# EAGLE design flipdotctl (EAGLE 6.4)

## Sheet 1 of 6
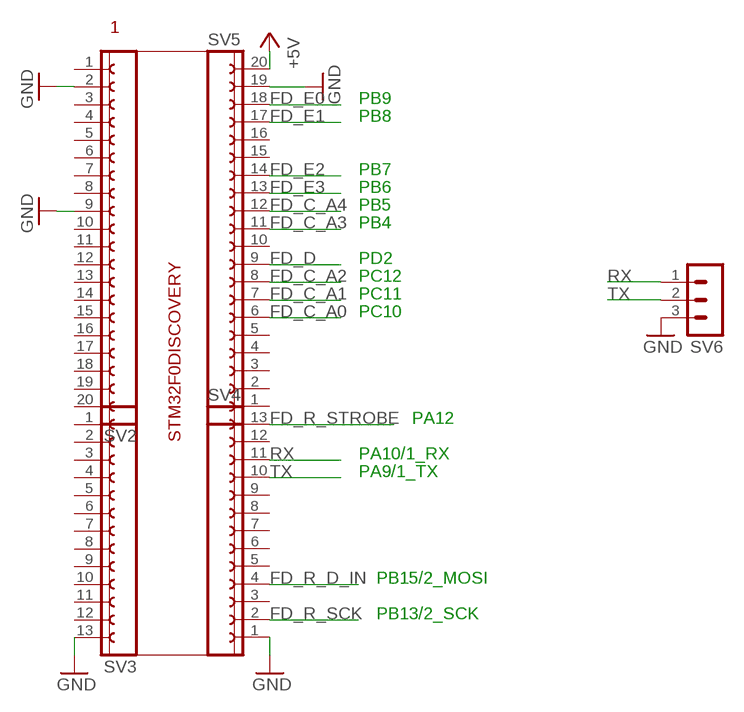
[diagram p0: schematic, sheet 1]

### Parts
SV2  FE20-1  [FE20]
SV3  FE13-1  [FE13]
SV4  FE13-1  [FE13]
SV5  FE20-1  [FE20]
SV6  MA03-1  [MA03-1]

### Nets
+5V: SV5.20 ; also sheet 2,3,4,5,6
FD_C_A0: SV5.6 ; also sheet 3
FD_C_A1: SV5.7 ; also sheet 3
FD_C_A2: SV5.8 ; also sheet 3
FD_C_A3: SV5.11 ; also sheet 3
FD_C_A4: SV5.12 ; also sheet 3
FD_D: SV5.9 ; also sheet 3
FD_E0: SV5.18 ; also sheet 3
FD_E1: SV5.17 ; also sheet 3
FD_E2: SV5.14 ; also sheet 3
FD_E3: SV5.13 ; also sheet 3
FD_R_D_IN: SV4.4 ; also sheet 4
FD_R_SCK: SV4.2 ; also sheet 4,5
FD_R_STROBE: SV4.13 ; also sheet 4,5
GND: SV2.2 SV2.9 SV3.13 SV4.1 SV5.19 SV6.3 ; also sheet 2,3,4,5,6
RX: SV4.11 SV6.1
TX: SV4.10 SV6.2
Unconnected: SV2.1 SV2.3 SV2.4 SV2.5 SV2.6 SV2.7 SV2.8 SV2.10 SV2.11 SV2.12 SV2.13 SV2.14 SV2.15 SV2.16 SV2.17 SV2.18 SV2.19 SV2.20 SV3.1 SV3.2 SV3.3 SV3.4 SV3.5 SV3.6 SV3.7 SV3.8 SV3.9 SV3.10 SV3.11 SV3.12 SV4.3 SV4.5 SV4.6 SV4.7 SV4.8 SV4.9 SV4.12 SV5.1 SV5.2 SV5.3 SV5.4 SV5.5 SV5.10 SV5.15 SV5.16

### Notes on the sheet
- 1
- PB9
- PB8
- PB7
- PB6
- PB5
- PB4
- PD2
- PC12
- PC11
- PC10
- PA12
- STM32F0DISCOVERY
- PA10/1_RX
- PA9/1_TX
- PB15/2_MOSI
- PB13/2_SCK

## Sheet 2 of 6
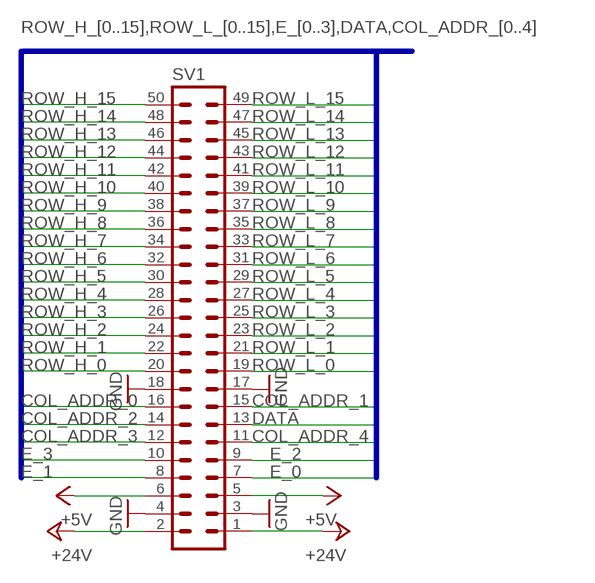
[diagram p1: schematic, sheet 2]

### Parts
SV1  ML50  [ML50]

### Nets
+5V: SV1.5 SV1.6 ; also sheet 1,3,4,5,6
+24V: SV1.1 SV1.2 ; also sheet 5,6
COL_ADDR_0: SV1.16 ; also sheet 3
COL_ADDR_1: SV1.15 ; also sheet 3
COL_ADDR_2: SV1.14 ; also sheet 3
COL_ADDR_3: SV1.12 ; also sheet 3
COL_ADDR_4: SV1.11 ; also sheet 3
DATA: SV1.13 ; also sheet 3
E_0: SV1.7 ; also sheet 3
E_1: SV1.8 ; also sheet 3
E_2: SV1.9 ; also sheet 3
E_3: SV1.10 ; also sheet 3
GND: SV1.3 SV1.4 SV1.17 SV1.18 ; also sheet 1,3,4,5,6
ROW_H_0: SV1.20 ; also sheet 5
ROW_H_1: SV1.22 ; also sheet 5
ROW_H_2: SV1.24 ; also sheet 5
ROW_H_3: SV1.26 ; also sheet 5
ROW_H_4: SV1.28 ; also sheet 5
ROW_H_5: SV1.30 ; also sheet 5
ROW_H_6: SV1.32 ; also sheet 5
ROW_H_7: SV1.34 ; also sheet 5
ROW_H_8: SV1.36 ; also sheet 5
ROW_H_9: SV1.38 ; also sheet 5
ROW_H_10: SV1.40 ; also sheet 5
ROW_H_11: SV1.42 ; also sheet 5
ROW_H_12: SV1.44 ; also sheet 5
ROW_H_13: SV1.46 ; also sheet 5
ROW_H_14: SV1.48 ; also sheet 5
ROW_H_15: SV1.50 ; also sheet 5
ROW_L_0: SV1.19 ; also sheet 4
ROW_L_1: SV1.21 ; also sheet 4
ROW_L_2: SV1.23 ; also sheet 4
ROW_L_3: SV1.25 ; also sheet 4
ROW_L_4: SV1.27 ; also sheet 4
ROW_L_5: SV1.29 ; also sheet 4
ROW_L_6: SV1.31 ; also sheet 4
ROW_L_7: SV1.33 ; also sheet 4
ROW_L_8: SV1.35 ; also sheet 4
ROW_L_9: SV1.37 ; also sheet 4
ROW_L_10: SV1.39 ; also sheet 4
ROW_L_11: SV1.41 ; also sheet 4
ROW_L_12: SV1.43 ; also sheet 4
ROW_L_13: SV1.45 ; also sheet 4
ROW_L_14: SV1.47 ; also sheet 4
ROW_L_15: SV1.49 ; also sheet 4

### Buses
ROW_H_[0..15],ROW_L_[0..15],E_[0..3],DATA,COL_ADDR_[0..4]

## Sheet 3 of 6
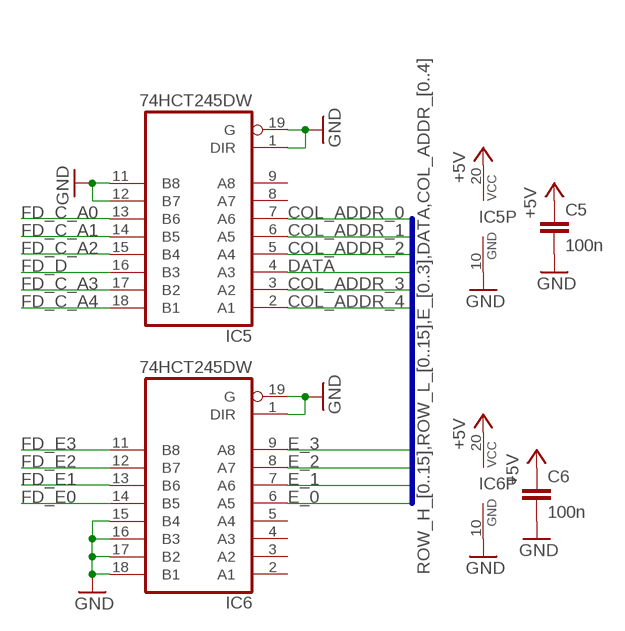
[diagram p2: schematic, sheet 3]

### Parts
C5  100n  C-EUC0603  [C0603]
C6  100n  C-EUC0603  [C0603]
IC5  74HCT245DW  [SO20W]
IC6  74HCT245DW  [SO20W]

### Nets
+5V: C5.1 C6.1 IC5.20(VCC) IC6.20(VCC) ; also sheet 1,2,4,5,6
COL_ADDR_0: IC5.7(A6) ; also sheet 2
COL_ADDR_1: IC5.6(A5) ; also sheet 2
COL_ADDR_2: IC5.5(A4) ; also sheet 2
COL_ADDR_3: IC5.3(A2) ; also sheet 2
COL_ADDR_4: IC5.2(A1) ; also sheet 2
DATA: IC5.4(A3) ; also sheet 2
E_0: IC6.6(A5) ; also sheet 2
E_1: IC6.7(A6) ; also sheet 2
E_2: IC6.8(A7) ; also sheet 2
E_3: IC6.9(A8) ; also sheet 2
FD_C_A0: IC5.13(B6) ; also sheet 1
FD_C_A1: IC5.14(B5) ; also sheet 1
FD_C_A2: IC5.15(B4) ; also sheet 1
FD_C_A3: IC5.17(B2) ; also sheet 1
FD_C_A4: IC5.18(B1) ; also sheet 1
FD_D: IC5.16(B3) ; also sheet 1
FD_E0: IC6.14(B5) ; also sheet 1
FD_E1: IC6.13(B6) ; also sheet 1
FD_E2: IC6.12(B7) ; also sheet 1
FD_E3: IC6.11(B8) ; also sheet 1
GND: C5.2 C6.2 IC5.1(DIR) IC5.10(GND) IC5.11(B8) IC5.12(B7) IC5.19(G) IC6.1(DIR) IC6.10(GND) IC6.15(B4) IC6.16(B3) IC6.17(B2) IC6.18(B1) IC6.19(G) ; also sheet 1,2,4,5,6
Unconnected: IC5.8(A7) IC5.9(A8) IC6.2(A1) IC6.3(A2) IC6.4(A3) IC6.5(A4)

### Buses
ROW_H_[0..15],ROW_L_[0..15],E_[0..3],DATA,COL_ADDR_[0..4]

## Sheet 4 of 6
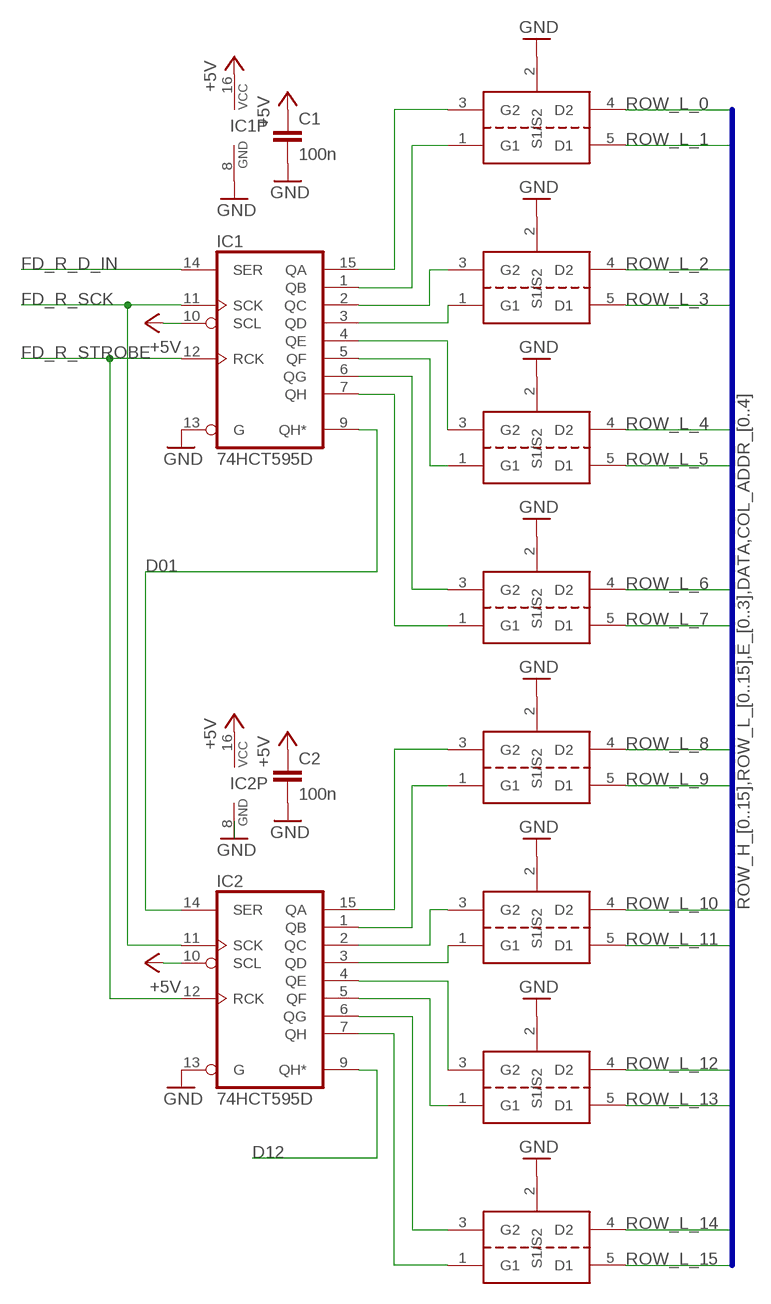
[diagram p3: schematic, sheet 4]

### Parts
C1  100n  C-EUC0603  [C0603]
C2  100n  C-EUC0603  [C0603]
IC1  74HCT595D  [SO16]
IC2  74HCT595D  [SO16]
U$1  QS5K2  [SOT23-5L]
U$2  QS5K2  [SOT23-5L]
U$3  QS5K2  [SOT23-5L]
U$4  QS5K2  [SOT23-5L]
U$5  QS5K2  [SOT23-5L]
U$6  QS5K2  [SOT23-5L]
U$7  QS5K2  [SOT23-5L]
U$8  QS5K2  [SOT23-5L]

### Nets
+5V: C1.1 C2.1 IC1.10(SCL) IC1.16(VCC) IC2.10(SCL) IC2.16(VCC) ; also sheet 1,2,3,5,6
D01: IC1.9(QH*) IC2.14(SER)
D12: IC2.9(QH*) ; also sheet 5
FD_R_D_IN: IC1.14(SER) ; also sheet 1
FD_R_SCK: IC1.11(SCK) IC2.11(SCK) ; also sheet 1,5
FD_R_STROBE: IC1.12(RCK) IC2.12(RCK) ; also sheet 1,5
GND: C1.2 C2.2 IC1.8(GND) IC1.13(G) IC2.8(GND) IC2.13(G) U$1.2(S1/S2) U$2.2(S1/S2) U$3.2(S1/S2) U$4.2(S1/S2) U$5.2(S1/S2) U$6.2(S1/S2) U$7.2(S1/S2) U$8.2(S1/S2) ; also sheet 1,2,3,5,6
L_0: IC1.15(QA) U$1.3(G2)
L_1: IC1.1(QB) U$1.1(G1)
L_2: IC1.2(QC) U$2.3(G2)
L_3: IC1.3(QD) U$2.1(G1)
L_4: IC1.4(QE) U$3.3(G2)
L_5: IC1.5(QF) U$3.1(G1)
L_6: IC1.6(QG) U$4.3(G2)
L_7: IC1.7(QH) U$4.1(G1)
L_8: IC2.15(QA) U$5.3(G2)
L_9: IC2.1(QB) U$5.1(G1)
L_10: IC2.2(QC) U$6.3(G2)
L_11: IC2.3(QD) U$6.1(G1)
L_12: IC2.4(QE) U$7.3(G2)
L_13: IC2.5(QF) U$7.1(G1)
L_14: IC2.6(QG) U$8.3(G2)
L_15: IC2.7(QH) U$8.1(G1)
ROW_L_0: U$1.4(D2) ; also sheet 2
ROW_L_1: U$1.5(D1) ; also sheet 2
ROW_L_2: U$2.4(D2) ; also sheet 2
ROW_L_3: U$2.5(D1) ; also sheet 2
ROW_L_4: U$3.4(D2) ; also sheet 2
ROW_L_5: U$3.5(D1) ; also sheet 2
ROW_L_6: U$4.4(D2) ; also sheet 2
ROW_L_7: U$4.5(D1) ; also sheet 2
ROW_L_8: U$5.4(D2) ; also sheet 2
ROW_L_9: U$5.5(D1) ; also sheet 2
ROW_L_10: U$6.4(D2) ; also sheet 2
ROW_L_11: U$6.5(D1) ; also sheet 2
ROW_L_12: U$7.4(D2) ; also sheet 2
ROW_L_13: U$7.5(D1) ; also sheet 2
ROW_L_14: U$8.4(D2) ; also sheet 2
ROW_L_15: U$8.5(D1) ; also sheet 2

### Buses
ROW_H_[0..15],ROW_L_[0..15],E_[0..3],DATA,COL_ADDR_[0..4]

## Sheet 5 of 6
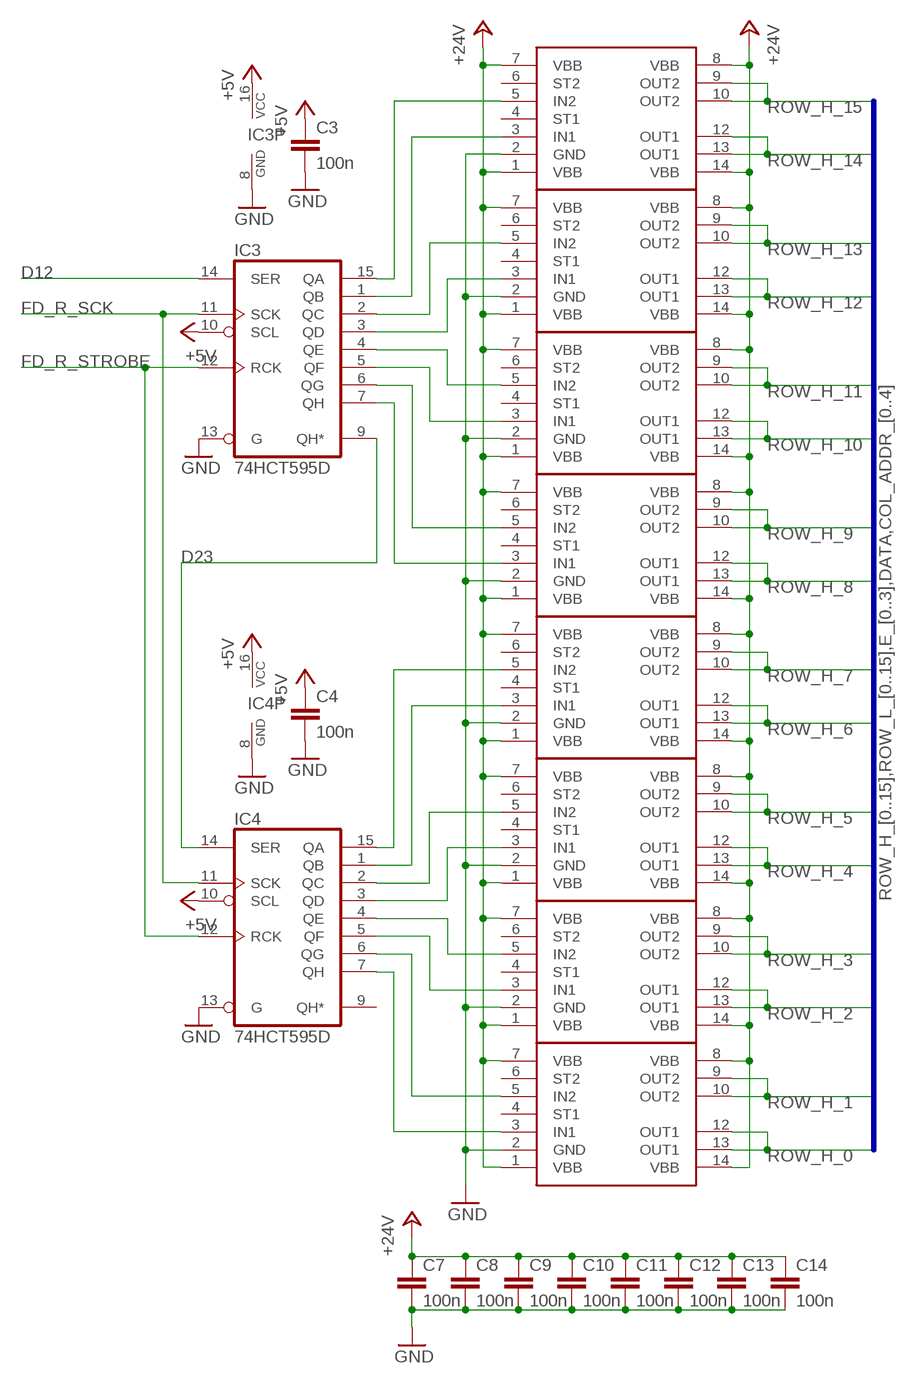
[diagram p4: schematic, sheet 5]

### Parts
C3  100n  C-EUC0603  [C0603]
C4  100n  C-EUC0603  [C0603]
C7  100n  C-EUC0603  [C0603]
C8  100n  C-EUC0603  [C0603]
C9  100n  C-EUC0603  [C0603]
C10  100n  C-EUC0603  [C0603]
C11  100n  C-EUC0603  [C0603]
C12  100n  C-EUC0603  [C0603]
C13  100n  C-EUC0603  [C0603]
C14  100n  C-EUC0603  [C0603]
IC3  74HCT595D  [SO16]
IC4  74HCT595D  [SO16]
U$9  BTS5210G  [SO-14]
U$10  BTS5210G  [SO-14]
U$11  BTS5210G  [SO-14]
U$12  BTS5210G  [SO-14]
U$13  BTS5210G  [SO-14]
U$14  BTS5210G  [SO-14]
U$15  BTS5210G  [SO-14]
U$16  BTS5210G  [SO-14]

### Nets
+5V: C3.1 C4.1 IC3.10(SCL) IC3.16(VCC) IC4.10(SCL) IC4.16(VCC) ; also sheet 1,2,3,4,6
+24V: C7.1 C8.1 C9.1 C10.1 C11.1 C12.1 C13.1 C14.1 U$9.1(VBB) U$9.7(VBB) U$9.8(VBB) U$9.14(VBB) U$10.1(VBB) U$10.7(VBB) U$10.8(VBB) U$10.14(VBB) U$11.1(VBB) U$11.7(VBB) U$11.8(VBB) U$11.14(VBB) U$12.1(VBB) U$12.7(VBB) U$12.8(VBB) U$12.14(VBB) U$13.1(VBB) U$13.7(VBB) U$13.8(VBB) U$13.14(VBB) U$14.1(VBB) U$14.7(VBB) U$14.8(VBB) U$14.14(VBB) U$15.1(VBB) U$15.7(VBB) U$15.8(VBB) U$15.14(VBB) U$16.1(VBB) U$16.7(VBB) U$16.8(VBB) U$16.14(VBB) ; also sheet 2,6
D12: IC3.14(SER) ; also sheet 4
D23: IC3.9(QH*) IC4.14(SER)
FD_R_SCK: IC3.11(SCK) IC4.11(SCK) ; also sheet 1,4
FD_R_STROBE: IC3.12(RCK) IC4.12(RCK) ; also sheet 1,4
GND: C3.2 C4.2 C7.2 C8.2 C9.2 C10.2 C11.2 C12.2 C13.2 C14.2 IC3.8(GND) IC3.13(G) IC4.8(GND) IC4.13(G) U$9.2(GND) U$10.2(GND) U$11.2(GND) U$12.2(GND) U$13.2(GND) U$14.2(GND) U$15.2(GND) U$16.2(GND) ; also sheet 1,2,3,4,6
H_0: IC4.7(QH) U$9.3(IN1)
H_1: IC4.6(QG) U$9.5(IN2)
H_2: IC4.5(QF) U$10.3(IN1)
H_3: IC4.4(QE) U$10.5(IN2)
H_4: IC4.3(QD) U$11.3(IN1)
H_5: IC4.2(QC) U$11.5(IN2)
H_6: IC4.1(QB) U$12.3(IN1)
H_7: IC4.15(QA) U$12.5(IN2)
H_8: IC3.7(QH) U$13.3(IN1)
H_9: IC3.6(QG) U$13.5(IN2)
H_10: IC3.5(QF) U$14.3(IN1)
H_11: IC3.4(QE) U$14.5(IN2)
H_12: IC3.3(QD) U$15.3(IN1)
H_13: IC3.2(QC) U$15.5(IN2)
H_14: IC3.1(QB) U$16.3(IN1)
H_15: IC3.15(QA) U$16.5(IN2)
ROW_H_0: U$9.12(OUT1) U$9.13(OUT1) ; also sheet 2
ROW_H_1: U$9.9(OUT2) U$9.10(OUT2) ; also sheet 2
ROW_H_2: U$10.12(OUT1) U$10.13(OUT1) ; also sheet 2
ROW_H_3: U$10.9(OUT2) U$10.10(OUT2) ; also sheet 2
ROW_H_4: U$11.12(OUT1) U$11.13(OUT1) ; also sheet 2
ROW_H_5: U$11.9(OUT2) U$11.10(OUT2) ; also sheet 2
ROW_H_6: U$12.12(OUT1) U$12.13(OUT1) ; also sheet 2
ROW_H_7: U$12.9(OUT2) U$12.10(OUT2) ; also sheet 2
ROW_H_8: U$13.12(OUT1) U$13.13(OUT1) ; also sheet 2
ROW_H_9: U$13.9(OUT2) U$13.10(OUT2) ; also sheet 2
ROW_H_10: U$14.12(OUT1) U$14.13(OUT1) ; also sheet 2
ROW_H_11: U$14.9(OUT2) U$14.10(OUT2) ; also sheet 2
ROW_H_12: U$15.12(OUT1) U$15.13(OUT1) ; also sheet 2
ROW_H_13: U$15.9(OUT2) U$15.10(OUT2) ; also sheet 2
ROW_H_14: U$16.12(OUT1) U$16.13(OUT1) ; also sheet 2
ROW_H_15: U$16.9(OUT2) U$16.10(OUT2) ; also sheet 2
Unconnected: IC4.9(QH*) U$9.4(ST1) U$9.6(ST2) U$10.4(ST1) U$10.6(ST2) U$11.4(ST1) U$11.6(ST2) U$12.4(ST1) U$12.6(ST2) U$13.4(ST1) U$13.6(ST2) U$14.4(ST1) U$14.6(ST2) U$15.4(ST1) U$15.6(ST2) U$16.4(ST1) U$16.6(ST2)

### Buses
ROW_H_[0..15],ROW_L_[0..15],E_[0..3],DATA,COL_ADDR_[0..4]

## Sheet 6 of 6
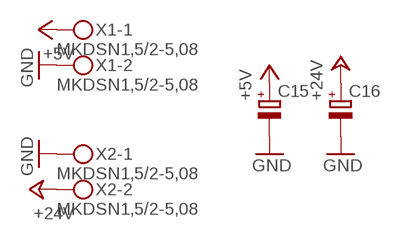
[diagram p5: schematic, sheet 6]

### Parts
C15  CPOL-EUE2.5-6  [E2,5-6]
C16  CPOL-EUE2.5-6  [E2,5-6]
X1  MKDSN1,5/2-5,08  [MKDSN1,5/2-5,08]
X2  MKDSN1,5/2-5,08  [MKDSN1,5/2-5,08]

### Nets
+5V: C15.+ X1.1 ; also sheet 1,2,3,4,5
+24V: C16.+ X2.2 ; also sheet 2,5
GND: C15.- C16.- X1.2 X2.1 ; also sheet 1,2,3,4,5

## Library data of the parts
C1-C14 = rcl:C-EU: CAPACITOR, European symbol
C15 C16 = rcl:CPOL-EU: POLARIZED CAPACITOR, European symbol
IC1-IC4 = 74xx-eu:74*595: 8-bit SHIFT REGISTER, output latch
IC5 IC6 = 74xx-eu:74*245: Octal BUS TRANSCEIVER, 3-state
SV1 = con-ml:ML50: HARTING; OC_FARNELL: unknown; OC_NEWARK: unknown
SV2 SV5 = con-lsta:FE20-1: FEMALE HEADER; OC_FARNELL: unknown; OC_NEWARK: unknown
SV3 SV4 = con-lsta:FE13-1: FEMALE HEADER; OC_FARNELL: unknown; OC_NEWARK: unknown
SV6 = con-lstb:MA03-1: PIN HEADER; OC_FARNELL: unknown; OC_NEWARK: unknown
U$1-U$8 = qs5k2:QS5K2
U$9-U$16 = BTS5210G:BTS5210G
X1 X2 = con-phoenix-508:MKDSN1,5/2-5,08: MKDSN 1,5/ 2-5,08 Printklemme Nennstrom: 13,5 A Nennspannung: 250 V Rastermaß: 5,08 mm Polzahl: 2 Anschlussart: Schraubanschluss Montage: Löten Anschlussrichtung Leiter/Platine: 0 ° Artikelnummer: 1729128 Source: http://eshop.phoenixcontact.com .. 1729128.pdf; MPN: MKDSN 1,5/2-5.08; OC_FARNELL: 1792903; OC_NEWARK: 30M2397

## Board
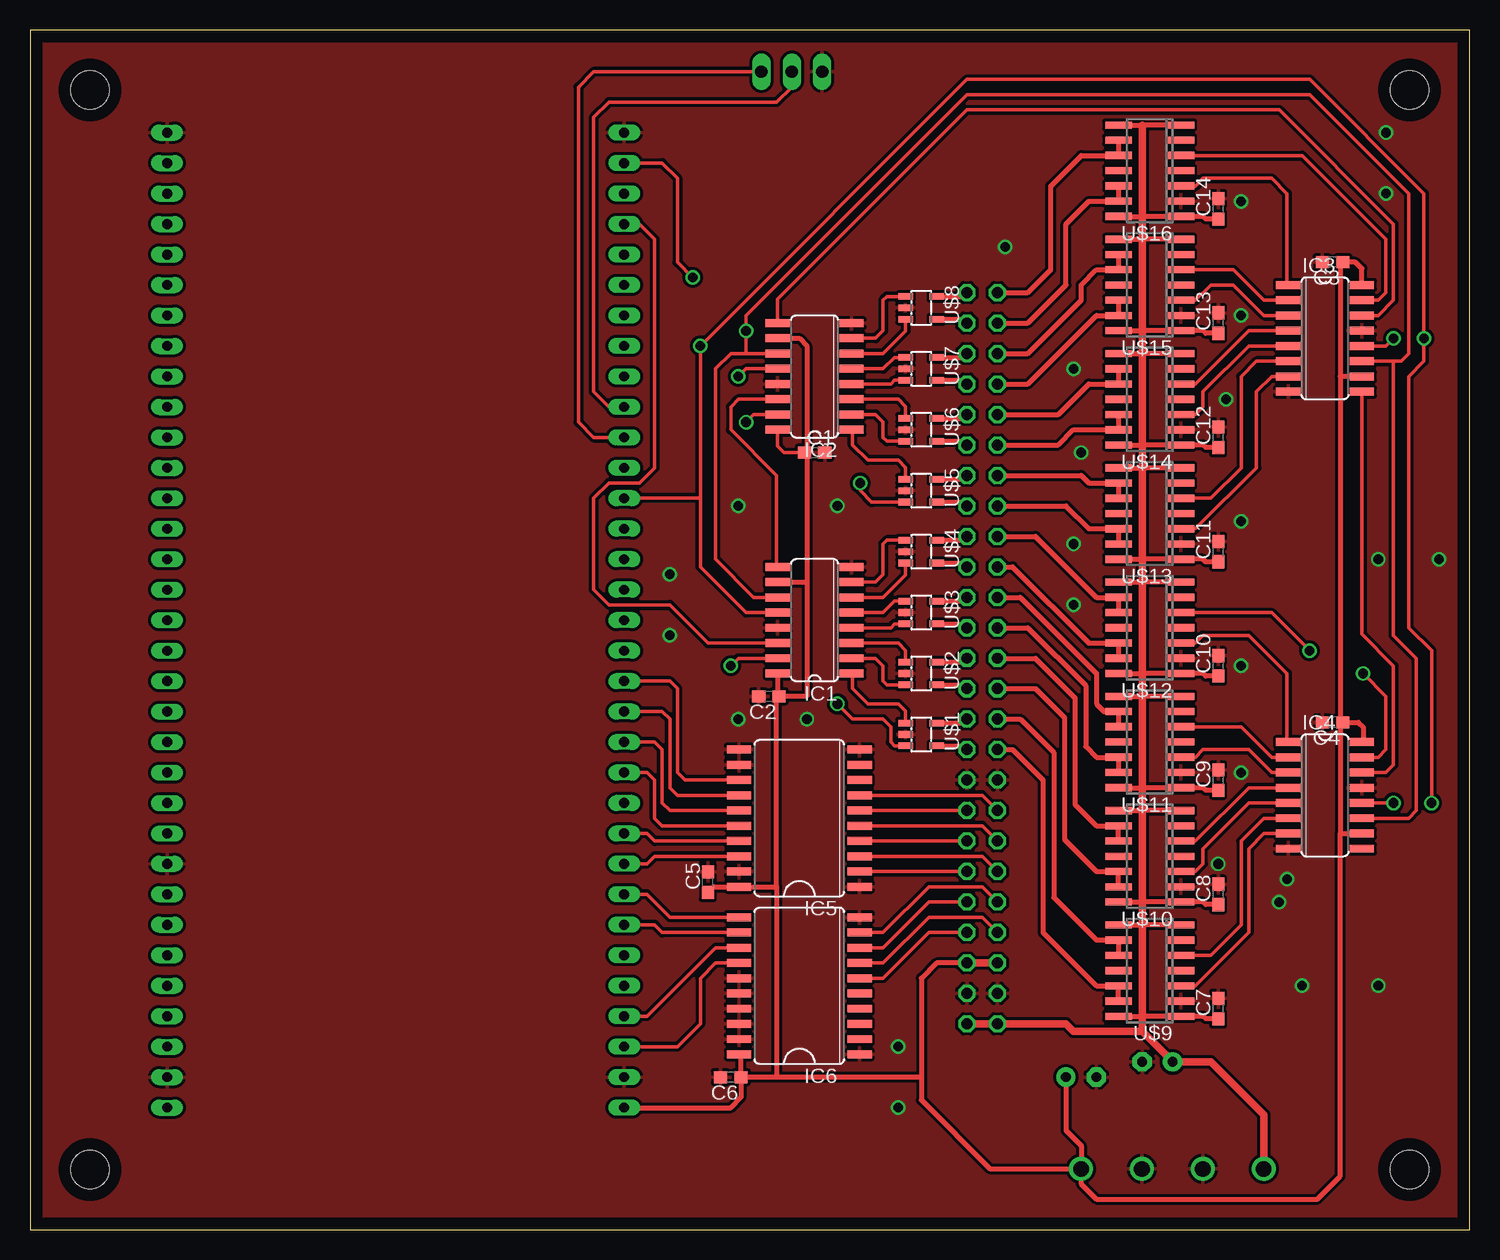
[diagram p6: board, top side]
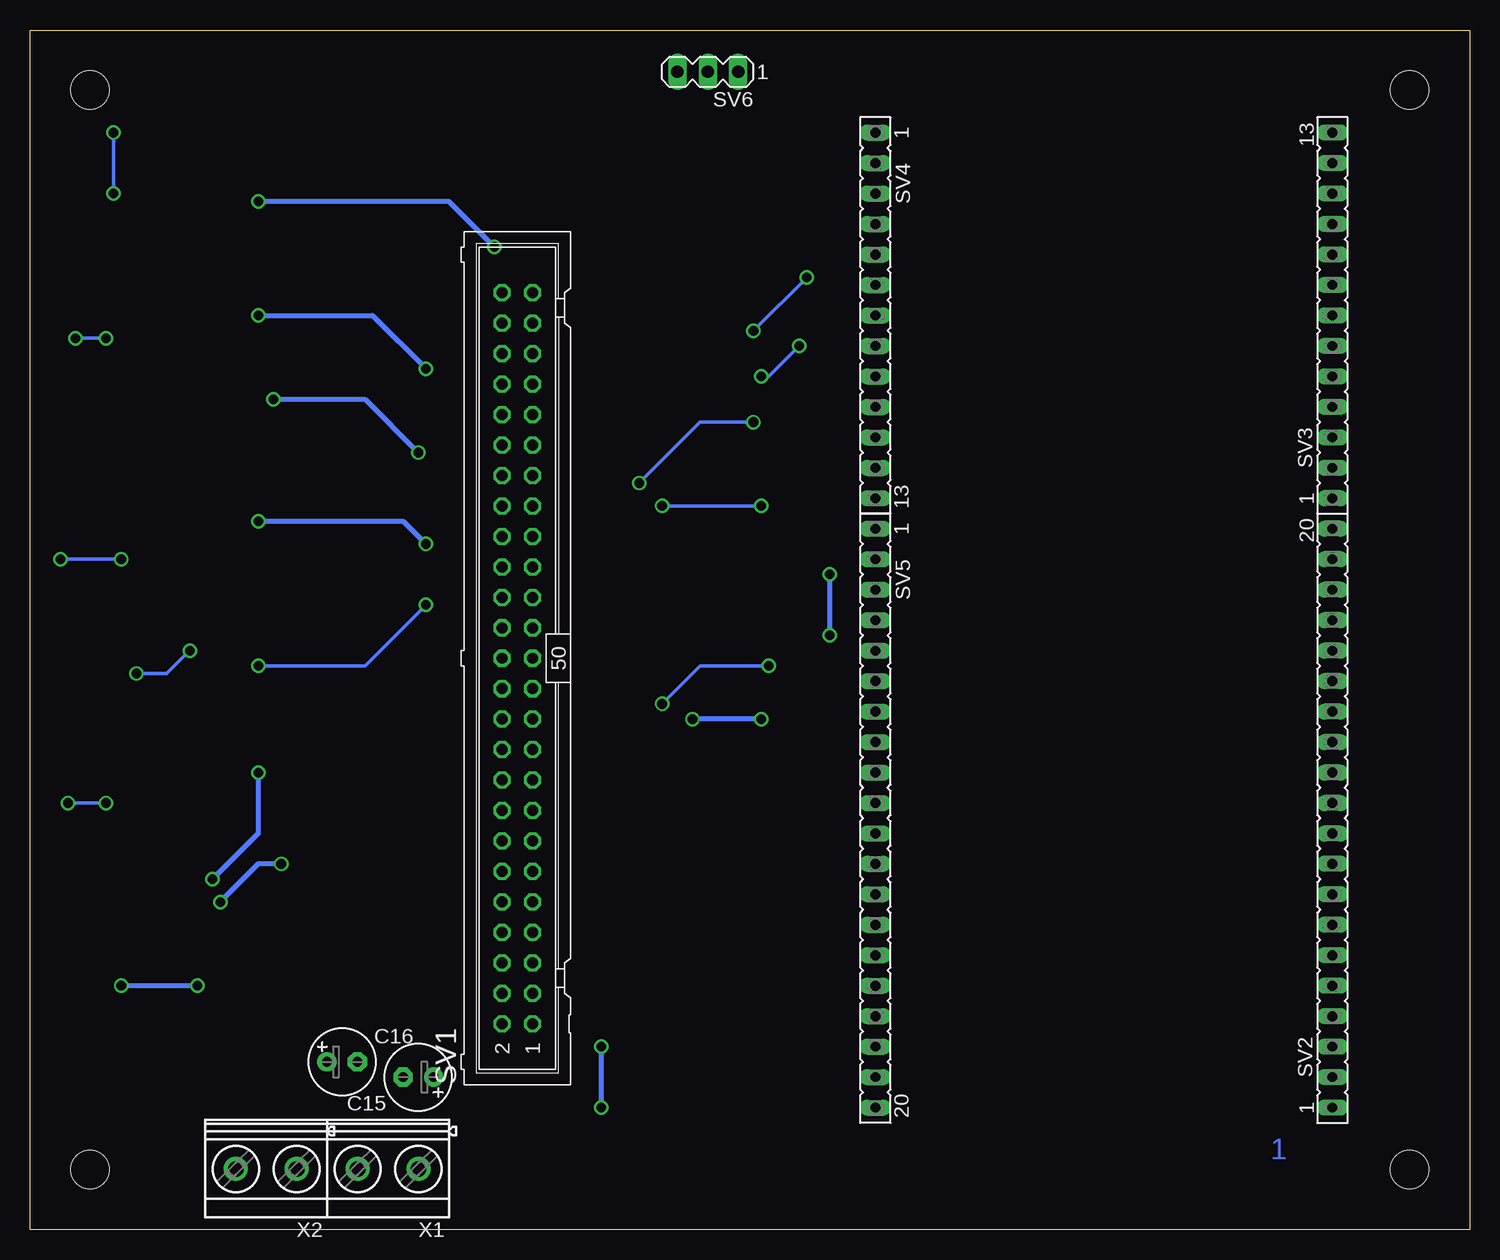
[diagram p7: board, bottom side, seen from below]

Size 120 x 100 mm. Coordinates in mm from the lower left corner, seen from the top.
Outline: 0,0 120,0 120,100 0,100 0,0
Copper layers (1*16): Top 0.035mm / dielectric 1.5mm / Bottom 0.035mm
Design rules "8mils *": minimum track width 8mil, minimum drill 0.6mm, track to track 8mil, track to pad 8mil, pad to pad 8mil, via to via 8mil, smd to smd 8mil, copper to edge 40mil, drill to drill 10mil, minimum pad ring 10mil, minimum via ring 8mil, stop-mask expansion 0mil, vias tented up to drill 0mil, thermal gap 10mil
Holes 3.2 mm at 5,95 5,5 115,5 115,95

### Footprints (pad centres in the part's own frame; a part is rotated, then mirrored left to right if it is on the bottom)
C0603 = smd 1.1 x 1: 1 -0.85,0; 2 0.85,0
E2,5-6 = drill 0.813 pad 1.6: + -1.27,0 | drill 0.813 pad 1.6 octagon: - 1.27,0
SO16 = smd 0.66 x 2.032: 1 -4.445,-3.073; 2 -3.175,-3.073; 3 -1.905,-3.073; 4 -0.635,-3.073; 5 0.635,-3.073; 6 1.905,-3.073; 7 3.175,-3.073; 8 4.445,-3.073; 9 4.445,3.073; 10 3.175,3.073; 11 1.905,3.073; 12 0.635,3.073; 13 -0.635,3.073; 14 -1.905,3.073; 15 -3.175,3.073; 16 -4.445,3.073
SO20W = smd 0.66 x 2.032: 1 -5.715,-5.029; 2 -4.445,-5.029; 3 -3.175,-5.029; 4 -1.905,-5.029; 5 -0.635,-5.029; 6 0.635,-5.029; 7 1.905,-5.029; 8 3.175,-5.029; 9 4.445,-5.029; 10 5.715,-5.029; 11 5.715,5.029; 12 4.445,5.029; 13 3.175,5.029; 14 1.905,5.029; 15 0.635,5.029; 16 -0.635,5.029; 17 -1.905,5.029; 18 -3.175,5.029; 19 -4.445,5.029; 20 -5.715,5.029
ML50 = drill 0.914 octagon: 1 -30.48,-1.27; 2 -30.48,1.27; 3 -27.94,-1.27; 4 -27.94,1.27; 5 -25.4,-1.27; 6 -25.4,1.27; 7 -22.86,-1.27; 8 -22.86,1.27; 9 -20.32,-1.27; 10 -20.32,1.27; 11 -17.78,-1.27; 12 -17.78,1.27; 13 -15.24,-1.27; 14 -15.24,1.27; 15 -12.7,-1.27; 16 -12.7,1.27; 17 -10.16,-1.27; 18 -10.16,1.27; 19 -7.62,-1.27; 20 -7.62,1.27; 21 -5.08,-1.27; 22 -5.08,1.27; 23 -2.54,-1.27; 24 -2.54,1.27; 25 0,-1.27; 26 0,1.27; 27 2.54,-1.27; 28 2.54,1.27; 29 5.08,-1.27; 30 5.08,1.27; 31 7.62,-1.27; 32 7.62,1.27; 33 10.16,-1.27; 34 10.16,1.27; 35 12.7,-1.27; 36 12.7,1.27; 37 15.24,-1.27; 38 15.24,1.27; 39 17.78,-1.27; 40 17.78,1.27; 41 20.32,-1.27; 42 20.32,1.27; 43 22.86,-1.27; 44 22.86,1.27; 45 25.4,-1.27; 46 25.4,1.27; 47 27.94,-1.27; 48 27.94,1.27; 49 30.48,-1.27; 50 30.48,1.27
FE20 = drill 0.813 long: 1 -24.13,0; 2 -21.59,0; 3 -19.05,0; 4 -16.51,0; 5 -13.97,0; 6 -11.43,0; 7 -8.89,0; 8 -6.35,0; 9 -3.81,0; 10 -1.27,0; 11 1.27,0; 12 3.81,0; 13 6.35,0; 14 8.89,0; 15 11.43,0; 16 13.97,0; 17 16.51,0; 18 19.05,0; 19 21.59,0; 20 24.13,0
FE13 = drill 0.813 long: 1 -15.24,0; 2 -12.7,0; 3 -10.16,0; 4 -7.62,0; 5 -5.08,0; 6 -2.54,0; 7 0,0; 8 2.54,0; 9 5.08,0; 10 7.62,0; 11 10.16,0; 12 12.7,0; 13 15.24,0
MA03-1 = drill 1.016 long: 1 -2.54,0; 2 0,0; 3 2.54,0
SOT23-5L = smd 0.55 x 1.2: 1 -0.95,-1.3; 2 0,-1.3; 3 0.95,-1.3; 4 0.95,1.3; 5 -0.95,1.3
SO-14 = smd 0.6 x 2.2: 1 -3.81,-2.6; 2 -2.54,-2.6; 3 -1.27,-2.6; 4 0,-2.6; 5 1.27,-2.6; 6 2.54,-2.6; 7 3.81,-2.6; 8 3.81,2.6; 9 2.54,2.6; 10 1.27,2.6; 11 0,2.6; 12 -1.27,2.6; 13 -2.54,2.6; 14 -3.81,2.6
MKDSN1,5/2-5,08 = drill 1.3 pad 2: 1 -2.561,0.025; 2 2.519,0.025

### Placement (x,y rotation side)
C1  65.41,64.77 0 top
C2  61.59,44.45 180 top
C3  108.58,80.64 180 top
C4  108.58,42.29 180 top
C5  56.52,28.96 90 top
C6  58.42,12.7 180 top
C7  99.06,18.41 90 top
C8  99.06,27.94 90 top
C9  99.06,37.47 90 top
C10  99.06,46.99 90 top
C11  99.06,56.52 90 top
C12  99.06,66.04 90 top
C13  99.06,75.56 90 top
C14  99.06,85.09 90 top
C15  87.63,12.7 180 bottom
C16  93.98,13.97 0 bottom
IC1  65.41,50.8 90 top
IC2  65.41,71.12 90 top
IC3  107.95,74.3 270 top
IC4  107.95,36.2 270 top
IC5  64.14,34.29 90 top
IC6  64.14,20.32 90 top
SV1  79.38,47.62 90 bottom
SV2  11.43,34.29 90 bottom
SV3  11.43,76.2 90 bottom
SV4  49.53,76.2 270 bottom
SV5  49.53,34.29 270 bottom
SV6  63.5,96.52 180 bottom
U$1  74.3,41.27 270 top
U$2  74.3,46.35 270 top
U$3  74.3,51.44 270 top
U$4  74.3,56.52 270 top
U$5  74.3,61.59 270 top
U$6  74.3,66.67 270 top
U$7  74.3,71.75 270 top
U$8  74.3,76.83 270 top
U$9  93.34,21.59 90 top
U$10  93.34,31.11 90 top
U$11  93.34,40.64 90 top
U$12  93.34,50.16 90 top
U$13  93.34,59.69 90 top
U$14  93.34,69.22 90 top
U$15  93.34,78.74 90 top
U$16  93.34,88.27 90 top
X1  90.17,5.08 180 bottom
X2  100.33,5.08 180 bottom

### Tracks (layer width: path | path; a pad name or v marks a point on that pad's centre or on a via)
+5V
  Top 0.305: C4.1 109.44,42.33 109.22,42.55 | 64.77,64.77 C1.1 62.87,64.77 62.33,65.3 IC2.16
  Top 0.406: SV1.5 75.56,22.23 74.3,20.95 74.3,12.7 | 74.3,12.7 62.23,12.7 | 62.23,12.7 C6.1 | C6.1 59.27,14.44 IC6.20 | SV5.20 58.42,10.16 59.27,11.01 C6.1 | C5.1 56.98,28.57 IC5.20 62.23,28.57 | 62.23,28.57 62.23,12.7 | 62.23,28.57 62.23,44.23 C2.1 | IC1.16 62.33,44.56 C2.1 | 109.22,33.02 109.22,4.45 107.31,2.54 88.9,2.54 87.61,3.83 X1.1 | 109.22,33.02 IC4.10 | 109.22,71.12 109.22,80.43 C3.1 110.49,80.64 111.02,80.11 IC3.16 | 109.22,71.12 109.22,42.55 109.22,33.02 | IC3.10 109.22,71.12 | C4.1 110.74,42.29 111.12,41.91 111.12,40.74 IC4.16 | 74.3,12.7 74.3,10.79 80.01,5.08 87.58,5.08 X1.1 | X1.1 87.63,5.08 87.63,6.99 86.36,8.26 C15.+ | IC1.10 64.77,53.98 | 64.77,53.98 64.77,44.45 C2.1 | 64.77,53.98 64.77,64.77 64.77,73.66 64.14,74.3 IC2.10
  Top 0.61: SV1.5 SV1.6
+24V
  Top 0.406: U$9.14 92.71,17.78 U$9.1 97.79,17.78 98,17.57 C7.1 | U$9.8 92.71,25.4 U$9.7 | U$10.14 92.71,27.3 U$10.1 97.79,27.3 98,27.09 C8.1 | U$10.8 92.71,34.92 U$10.7 | U$11.14 92.71,36.83 U$11.1 97.79,36.83 98,36.62 C9.1 | U$11.8 92.71,44.45 U$11.7 | U$12.14 92.71,46.35 U$12.1 97.79,46.35 98,46.14 C10.1 | U$12.8 92.71,53.98 U$12.7 | U$13.14 92.71,55.88 U$13.1 97.79,55.88 98,55.66 C11.1 | U$13.8 92.71,63.5 U$13.7 | U$14.14 92.71,65.41 U$14.1 97.79,65.41 98,65.19 C12.1 | U$15.14 92.71,74.93 U$15.1 97.79,74.93 98,74.72 C13.1 | U$14.8 92.71,73.03 U$14.7 | U$15.8 92.71,82.55 U$15.7 | U$16.14 92.71,84.45 U$16.1 97.79,84.45 98,84.24 C14.1 | U$16.8 92.71,92.08 U$16.7
  Top 0.61: SV1.1 SV1.2 86.36,17.14 87,16.51 92.71,16.51 | 92.71,16.51 92.71,17.78 92.71,25.4 92.71,27.3 92.71,34.92 92.71,36.83 92.71,44.45 92.71,46.35 92.71,53.98 92.71,55.88 92.71,63.5 92.71,65.41 92.71,73.03 92.71,74.93 92.71,82.55 92.71,84.45 92.71,92.08 | X2.2 102.85,9.55 98.42,13.97 C16.+ 92.71,16.51
COL_ADDR_0
  Top 0.305: SV1.16 79.38,36.2 IC5.7
COL_ADDR_1
  Top 0.305: IC5.6 SV1.15
COL_ADDR_2
  Top 0.305: SV1.14 79.38,33.66 IC5.5
COL_ADDR_3
  Top 0.305: IC5.3 79.38,31.11 SV1.12
COL_ADDR_4
  Top 0.305: IC5.2 SV1.11
D01
  Top 0.305: IC1.9 62.23,55.24 62.23,62.87 58.42,66.67 58.42,68.58 59.05,69.22 IC2.14
D12
  Top 0.305: IC2.9 62.33,77.57 78.11,93.34 104.14,93.34 113.67,83.82 113.67,77.47 112.39,76.2 IC3.14
D23
  Top 0.305: IC3.9 111.02,49.63 113.67,46.99 113.67,38.73 113.03,38.1 IC4.14
DATA
  Top 0.305: IC5.4 SV1.13
E_0
  Top 0.305: SV1.7 74.93,24.77 71.12,20.95 IC6.6
E_1
  Top 0.305: SV1.8 79.38,26.04 74.93,26.04 71.12,22.23 IC6.7
E_2
  Top 0.305: SV1.9 74.93,27.3 71.12,23.5 IC6.8
E_3
  Top 0.305: SV1.10 79.38,28.57 74.93,28.57 71.12,24.77 IC6.9
FD_C_A0
  Top 0.305: IC5.13 54.61,37.47 53.98,38.1 53.98,45.09 53.34,45.72 SV5.6
FD_C_A1
  Top 0.305: IC5.14 53.98,36.2 53.34,36.83 53.34,42.55 52.7,43.18 SV5.7
FD_C_A2
  Top 0.305: IC5.15 53.34,34.92 52.7,35.56 52.7,40.01 52.07,40.64 SV5.8
FD_C_A3
  Top 0.305: IC5.17 52.07,32.38 51.44,33.02 SV5.11
FD_C_A4
  Top 0.305: IC5.18 52.07,31.11 51.44,30.48 SV5.12
FD_D
  Top 0.305: IC5.16 52.7,33.66 52.07,34.29 52.07,37.47 51.44,38.1 SV5.9
FD_E0
  Top 0.305: IC6.14 57.15,22.23 55.88,20.95 55.88,17.14 53.98,15.24 SV5.18
FD_E1
  Top 0.305: IC6.13 57.15,23.5 51.44,17.78 SV5.17
FD_E2
  Top 0.305: IC6.12 52.7,24.77 52.07,25.4 SV5.14
FD_E3
  Top 0.305: IC6.11 53.34,26.04 51.44,27.94 SV5.13
FD_R_D_IN
  Top 0.305: IC1.14 56.52,48.9 53.34,52.07 48.26,52.07 46.99,53.34 46.99,60.96 48.26,62.23 50.8,62.23 52.07,63.5 52.07,82.55 50.8,83.82 SV4.4
FD_R_SCK  (via drill 0.8)
  Top 0.305: IC3.11 113.67,72.39 | 113.67,72.39 113.67,49.53 115.57,47.62 115.57,34.92 114.94,34.29 IC4.11 | 113.67,72.39 114.3,72.39 114.94,73.03 114.94,86.36 106.68,94.61 78.11,94.61 59.69,76.2 v59.69,74.93 59.69,73.03 | IC1.11 60.33,52.7 57.15,55.88 57.15,71.75 58.42,73.03 59.69,73.03 | 59.69,73.03 IC2.11 | SV4.2 52.7,88.9 53.98,87.63 53.98,80.64 v55.24,79.38
  Bottom 0.305: v55.24,79.38 v59.69,74.93
FD_R_STROBE  (via drill 0.8)
  Top 0.305: IC4.12 v113.67,35.56 | v116.84,35.56 116.84,48.26 114.94,50.16 114.94,71.12 116.2,72.39 v116.2,74.3 116.2,86.36 106.68,95.89 78.11,95.89 v55.88,73.66 55.88,60.96 | IC3.12 113.03,73.66 v113.67,74.3 | IC1.12 59.69,51.44 55.88,55.24 55.88,60.96 | 55.88,60.96 SV4.13 | IC2.12 59.69,71.75 v59.05,71.12
  Bottom 0.305: v113.67,35.56 v116.84,35.56 | v113.67,74.3 v116.2,74.3 | v59.05,71.12 58.42,71.12 v55.88,73.66
GND  (via drill 0.8)
  Bottom 0.305: v100.97,46.99 92.08,46.99 v87,52.07 | v112.39,55.88 v117.47,55.88 | v113.03,91.44 v113.03,86.36 | v59.05,60.33 v67.31,60.33
  Bottom 0.406: v100.97,76.2 91.44,76.2 v87,71.75 | v100.97,85.72 85.09,85.72 v81.28,81.92 | v99.69,69.22 92.08,69.22 v87.63,64.77 | v100.97,59.05 88.9,59.05 v87,57.15 | v99.06,30.48 100.97,30.48 v104.14,27.3 | v100.97,38.1 100.97,33.02 v104.78,29.21 | v106.05,20.32 v112.39,20.32 | v59.05,42.55 v64.77,42.55 | v72.39,15.24 v72.39,10.16 | v53.34,54.61 v53.34,49.53
  pour Top (isolate 0.254): -1.27,101.6 121.92,101.6 121.92,-1.27 -1.27,-1.27
H_0
  Top 0.305: IC4.7 102.87,33.02 101.6,31.75 101.6,24.77 97.16,20.32 U$9.3
H_1
  Top 0.305: IC4.6 102.87,34.29 100.97,32.38 100.97,25.4 98.42,22.86 U$9.5
H_2
  Top 0.305: U$10.3 97.16,29.84 97.79,30.48 97.79,31.75 101.6,35.56 IC4.5
H_3
  Top 0.305: IC4.4 101.6,36.83 97.16,32.38 U$10.5
H_4
  Top 0.305: U$11.3 97.16,39.37 97.79,40.01 101.6,40.01 103.5,38.1 IC4.3
H_5
  Top 0.305: U$11.5 100.97,41.91 103.5,39.37 IC4.2
H_6
  Top 0.305: IC4.1 104.78,40.74 104.78,46.35 101.6,49.53 97.79,49.53 97.16,48.9 U$12.3
H_7  (via drill 0.8)
  Top 0.305: U$12.5 103.5,51.44 v106.68,48.26 | IC4.15 112.39,39.37 113.03,40.01 113.03,44.45 v111.12,46.35
  Bottom 0.305: v106.68,48.26 108.58,46.35 v111.12,46.35
H_8
  Top 0.305: U$13.3 97.16,58.42 102.23,63.5 102.23,69.85 103.5,71.12 IC3.7
H_9
  Top 0.305: IC3.6 102.23,72.39 100.97,71.12 100.97,63.5 98.42,60.96 U$13.5
H_10
  Top 0.305: IC3.5 101.6,73.66 97.79,69.85 97.79,68.58 97.16,67.94 U$14.3
H_11
  Top 0.305: IC3.4 101.6,74.93 97.16,70.48 U$14.5
H_12
  Top 0.305: U$15.3 97.16,77.47 98.42,78.74 100.33,78.74 102.87,76.2 IC3.3
H_13
  Top 0.305: U$15.5 100.33,80.01 102.87,77.47 IC3.2
H_14
  Top 0.305: U$16.3 97.16,87 97.79,87.63 103.5,87.63 104.78,86.36 104.78,78.84 IC3.1
H_15
  Top 0.305: U$16.5 106.05,89.53 113.03,82.55 113.03,78.11 112.39,77.47 IC3.15
L_0  (via drill 0.8)
  Top 0.305: IC1.15 59.05,47.62 v58.42,46.99 | v67.31,43.81 68.58,42.55 71.12,42.55 71.75,41.91 71.75,40.64 72.07,40.33 U$1.3
  Bottom 0.305: v58.42,46.99 64.14,46.99 v67.31,43.81
L_1
  Top 0.305: U$1.1 73,43.21 72.39,43.81 69.85,43.81 68.58,45.09 68.58,46.25 IC1.1
L_2
  Top 0.305: U$2.3 71.44,45.41 71.12,45.72 71.12,46.99 70.48,47.62 IC1.2
L_3
  Top 0.305: U$2.1 73,48.29 72.39,48.9 IC1.3
L_4
  Top 0.305: U$3.3 72.08,50.48 71.75,50.16 IC1.4
L_5
  Top 0.305: U$3.1 72.07,52.38 71.12,51.44 IC1.5
L_6
  Top 0.305: U$4.3 73,54.58 71.12,52.7 IC1.6
L_7
  Top 0.305: U$4.1 71.44,57.47 71.12,57.15 71.12,54.61 70.48,53.98 IC1.7
L_8  (via drill 0.8)
  Top 0.305: IC2.15 60.33,67.94 v59.69,67.31 | v69.22,62.23 69.22,61.59 70.17,60.65 U$5.3
  Bottom 0.305: v59.69,67.31 64.14,67.31 v69.22,62.23
L_9
  Top 0.305: U$5.1 73,63.53 72.39,64.14 69.85,64.14 68.58,65.41 68.58,66.57 IC2.1
L_10
  Top 0.305: U$6.3 71.44,65.72 71.12,66.04 71.12,67.31 70.48,67.94 IC2.2
L_11
  Top 0.305: U$6.1 73,68.61 72.39,69.22 IC2.3
L_12
  Top 0.305: U$7.3 72.08,70.81 71.75,70.48 IC2.4
L_13
  Top 0.305: U$7.1 72.07,72.7 71.12,71.75 IC2.5
L_14
  Top 0.305: U$8.3 73,74.9 71.12,73.03 IC2.6
L_15
  Top 0.305: U$8.1 71.44,77.78 71.12,77.47 71.12,74.93 70.48,74.3 IC2.7
ROW_H_0
  Top 0.406: U$9.13 U$9.12 88.9,20.32 84.45,24.77 84.45,37.47 81.92,40.01 SV1.20
ROW_H_1
  Top 0.406: U$9.10 U$9.9 88.9,24.13 85.34,27.69 85.34,39.75 82.55,42.55 SV1.22
ROW_H_2
  Top 0.406: U$10.13 U$10.12 88.9,29.84 86.23,32.51 86.23,42.67 83.82,45.09 SV1.24
ROW_H_3
  Top 0.406: U$10.10 U$10.9 88.9,33.66 87.12,35.43 87.12,44.32 83.82,47.62 SV1.26
ROW_H_4
  Top 0.406: U$11.13 U$11.12 88.9,39.37 88.01,40.26 88.01,45.34 83.19,50.16 SV1.28
ROW_H_5
  Top 0.406: U$11.10 U$11.9 89.53,43.18 88.9,43.81 88.9,46.35 82.55,52.7 SV1.30
ROW_H_6
  Top 0.406: U$12.13 U$12.12 88.27,48.9 81.92,55.24 SV1.32
ROW_H_7
  Top 0.406: U$12.10 U$12.9 88.9,52.7 83.82,57.78 SV1.34
ROW_H_8
  Top 0.406: U$13.13 U$13.12 88.27,58.42 86.36,60.33 SV1.36
ROW_H_9
  Top 0.406: U$13.10 U$13.9 88.27,62.23 87.63,62.87 SV1.38
ROW_H_10
  Top 0.406: U$14.12 U$14.13 87,66.67 85.72,65.41 SV1.40
ROW_H_11
  Top 0.406: U$14.9 U$14.10 88.27,70.48 85.72,67.94 SV1.42
ROW_H_12
  Top 0.406: U$15.12 U$15.13 88.9,76.2 83.19,70.48 SV1.44
ROW_H_13
  Top 0.406: U$15.9 U$15.10 88.9,80.01 87.63,78.74 87.63,77.47 83.19,73.03 SV1.46
ROW_H_14
  Top 0.406: U$16.12 U$16.13 88.27,85.72 86.36,83.82 86.36,78.74 83.19,75.56 SV1.48
ROW_H_15
  Top 0.406: U$16.9 U$16.10 87.63,89.53 85.09,87 85.09,80.01 83.19,78.11 SV1.50
ROW_L_0
  Top 0.406: U$1.4 77.78,40.33 SV1.19
ROW_L_1
  Top 0.406: U$1.5 77.78,42.23 SV1.21
ROW_L_2
  Top 0.406: U$2.4 77.78,45.41 SV1.23
ROW_L_3
  Top 0.406: U$2.5 77.78,47.3 SV1.25
ROW_L_4
  Top 0.406: U$3.4 77.78,50.48 SV1.27
ROW_L_5
  Top 0.406: U$3.5 77.78,52.38 SV1.29
ROW_L_6
  Top 0.406: U$4.4 77.78,55.56 SV1.31
ROW_L_7
  Top 0.406: U$4.5 77.78,57.47 SV1.33
ROW_L_8
  Top 0.406: U$5.4 77.78,60.65 SV1.35
ROW_L_9
  Top 0.406: U$5.5 77.78,62.55 SV1.37
ROW_L_10
  Top 0.406: U$6.4 77.78,65.72 SV1.39
ROW_L_11
  Top 0.406: U$6.5 77.78,67.62 SV1.41
ROW_L_12
  Top 0.406: U$7.4 77.78,70.81 SV1.43
ROW_L_13
  Top 0.406: U$7.5 77.78,72.7 SV1.45
ROW_L_14
  Top 0.406: U$8.4 77.78,75.89 SV1.47
ROW_L_15
  Top 0.406: U$8.5 77.78,77.78 SV1.49
RX
  Top 0.305: SV6.1 46.99,96.52 45.72,95.25 45.72,67.31 46.99,66.04 SV4.11
TX
  Top 0.305: SV6.2 63.5,95.25 62.23,93.98 48.26,93.98 46.99,92.71 46.99,69.85 48.26,68.58 SV4.10

### Text on the board
Bottom: 1